# Altium schematic sheet CONNECTIONS.SchDoc: CONNECTIONS
size A4; DocumentNumber: 7; Revision: 2.0; SheetNumber: 7; SheetTotal: 18
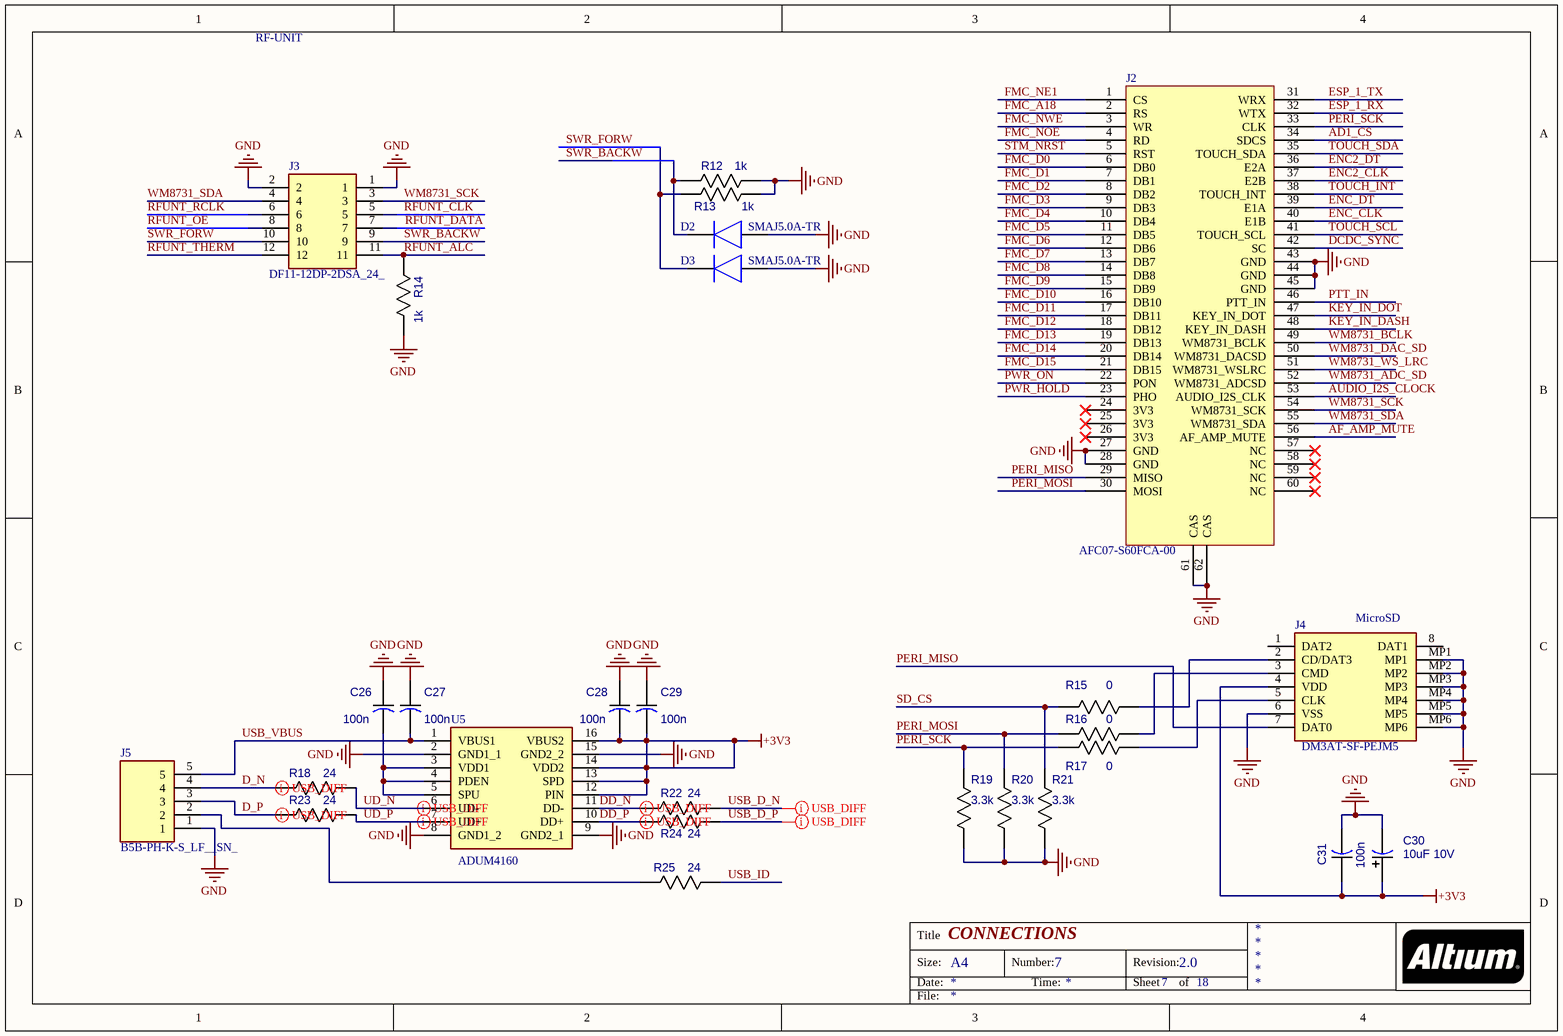
[diagram p0: CONNECTIONS.SchDoc]

## Parts
C26  100n  [CAP_0805]
C27  100n  [CAP_0805]
C28  100n  [CAP_0805]
C29  100n  [CAP_0805]
C30  value 10uF 10V  [CAPAE_4.3x4.3h5.4]  (hidden comment: 22uF 10V)
C31  100n  [CAP_0805]
D2  SMAJ5.0A-TR  [SMBJ36CATR]
D3  SMAJ5.0A-TR  [SMBJ36CATR]
J2  AFC07-S60FCA-00  [AFC07-S60FCA-00]
J3  DF11-12DP-2DSA_24_  [SHDR12W60P200_2X6_1400X500X690P]
J4  DM3AT-SF-PEJM5  [DM3ATSFPEJM5]
J5  B5B-PH-K-S_LF__SN_  [SHDR5W50P0X200_1X5_1190X450X600P]
R12  1k  [RES_0805]
R13  1k  [RES_0805]
R14  1k  [RES_0805]
R15  0  [RES_0805]
R16  0  [RES_0805]
R17  0  [RES_0805]
R18  24  [RES_0805]
R19  3.3k  [RES_0805]
R20  3.3k  [RES_0805]
R21  3.3k  [RES_0805]
R22  24  [RES_0805]
R23  24  [RES_0805]
R24  24  [RES_0805]
R25  24  [RES_0805]
U5  ADUM4160  [SOIC127P1032X265-16N]

## Nets
+3V3: C28.2 C29.2 C30.1(PLUS) C31.1 J4.4(VDD) U5.12(PIN) U5.13(SPD) U5.14(VDD2) U5.16(VBUS2)
GND: C26.1 C27.1 C28.1 C29.1 C30.2(MINUS) C31.2 D2.2(A) D3.2(A) J2.27(GND) J2.28(GND) J2.43(GND) J2.44(GND) J2.45(GND) J2.61(CAS) J2.62(CAS) J3.1 J3.2 J4.6(VSS) J4.MP1 J4.MP2 J4.MP3 J4.MP4 J4.MP5 J4.MP6 J5.1 R12.2 R13.2 R14.2 R19.1 R20.1 R21.1 U5.2(GND1_1) U5.8(GND1_2) U5.9(GND2_1) U5.15(GND2_2)
AD1_CS: J2.34(SDCS)
AF_AMP_MUTE: J2.56(AF_AMP_MUTE)
AUDIO_I2S_CLOCK: J2.53(AUDIO_I2S_CLK)
D_N: J5.4 R18.1
D_P: J5.3 R23.1
DCDC_SYNC: J2.42(SC)
DD_N: R22.1 U5.11(DD-)
DD_P: R24.1 U5.10(DD+)
ENC2_CLK: J2.37(E2B)
ENC2_DT: J2.36(E2A)
ENC_CLK: J2.40(E1B)
ENC_DT: J2.39(E1A)
ESP_1_RX: J2.32(WTX)
ESP_1_TX: J2.31(WRX)
FMC_A18: J2.2(RS)
FMC_D0: J2.6(DB0)
FMC_D1: J2.7(DB1)
FMC_D2: J2.8(DB2)
FMC_D3: J2.9(DB3)
FMC_D4: J2.10(DB4)
FMC_D5: J2.11(DB5)
FMC_D6: J2.12(DB6)
FMC_D7: J2.13(DB7)
FMC_D8: J2.14(DB8)
FMC_D9: J2.15(DB9)
FMC_D10: J2.16(DB10)
FMC_D11: J2.17(DB11)
FMC_D12: J2.18(DB12)
FMC_D13: J2.19(DB13)
FMC_D14: J2.20(DB14)
FMC_D15: J2.21(DB15)
FMC_NE1: J2.1(CS)
FMC_NOE: J2.4(RD)
FMC_NWE: J2.3(WR)
KEY_IN_DASH: J2.48(KEY_IN_DASH)
KEY_IN_DOT: J2.47(KEY_IN_DOT)
PERI_MISO: J2.29(MISO) J4.7(DAT0)
PERI_MOSI: J2.30(MOSI) R16.2 R20.2
PERI_SCK: J2.33(CLK) R17.2 R19.2
PTT_IN: J2.46(PTT_IN)
PWR_HOLD: J2.23(PHO)
PWR_ON: J2.22(PON)
RFUNT_ALC: J3.11 R14.1
RFUNT_CLK: J3.5
RFUNT_DATA: J3.7
RFUNT_OE: J3.8
RFUNT_RCLK: J3.6
RFUNT_THERM: J3.12
SD_CS: R15.2 R21.2
STM_NRST: J2.5(RST)
SWR_BACKW: D2.1(K) J3.9 R12.1
SWR_FORW: D3.1(K) J3.10 R13.1
TOUCH_INT: J2.38(TOUCH_INT)
TOUCH_SCL: J2.41(TOUCH_SCL)
TOUCH_SDA: J2.35(TOUCH_SDA)
UD_N: R18.2 U5.6(UD-)
UD_P: R23.2 U5.7(UD+)
USB_D_N: R22.2
USB_D_P: R24.2
USB_ID: R25.2
USB_VBUS: C27.2 J5.5 U5.1(VBUS1)
WM8731_ADC_SD: J2.52(WM8731_ADCSD)
WM8731_BCLK: J2.49(WM8731_BCLK)
WM8731_DAC_SD: J2.50(WM8731_DACSD)
WM8731_SCK: J2.54(WM8731_SCK) J3.3
WM8731_SDA: J2.55(WM8731_SDA) J3.4
WM8731_WS_LRC: J2.51(WM8731_WSLRC)
NetC26_2: C26.2 U5.3(VDD1) U5.4(PDEN) U5.5(SPU)
NetJ4_2: J4.2(CD/DAT3) R15.1
NetJ4_3: J4.3(CMD) R16.1
NetJ4_5: J4.5(CLK) R17.1
NetJ5_2: J5.2 R25.1

Not connected (* = marked no-connect by the designer): J2 24(3V3)* 25(3V3)* 26(3V3)* 57(NC)* 58(NC)* 59(NC)* 60(NC)*; J4 1(DAT2) 8(DAT1)

## Layout directives
differential pair; differential pair class USB_DIFF: D_N, D_P, DD_N, DD_P, UD_N, UD_P, USB_D_N, USB_D_P

## Notes on the sheet
- RF-UNIT
- (near J4) MicroSD
- Title
- Size:
- Date:
- A4
- Number:
- Time:
- Revision:
- Sheet
- of
- File:

## Library data of the parts
C26-C29 C31 = CAP_0805: Value: 100n
C30 = CAPAE_4.3x4.3h5.4
D2 D3 = SMLVT3V3: Diode; Manufacturer_Name: STMicroelectronics; Allied_Number: 70013736; Datasheet Link: http://www.st.com/web/en/resource/technical/document/datasheet/CD00000923.pdf; Height: 2.65mm; Manufacturer_Part_Number: SMLVT3V3; Mouser Part Number: 511-SMLVT3V3; Mouser Price/Stock: https://www.mouser.com/Search/Refine.aspx?Keyword=511-SMLVT3V3; RS Part Number: 5444821P; RS Price/Stock: http://uk.rs-online.com/web/p/products/5444821P; Allied Price/Stock: http://www.alliedelec.com/stmicroelectronics-smlvt3v3/70013736/
J3 = DF11-12DP-2DSA_24_: Connector; Manufacturer_Name: Hirose; Manufacturer_Part_Number: DF11-12DP-2DSA(24); Datasheet Link: https://datasheet.datasheetarchive.com/originals/distributors/SFDatasheet-7/sf-000141225.pdf; Height: 6.9mm; Mouser Part Number: 798-DF11-12DP-2DSA24; Mouser Price/Stock: https://www.mouser.co.uk/ProductDetail/Hirose-Connector/DF11-12DP-2DSA24?qs=zOgoZG1CgI9hGIQfeQgy6Q%3D%3D; Arrow Part Number: DF11-12DP-2DSA(24); Arrow Price/Stock: https://www.arrow.com/en/products/df11-12dp-2dsa-24/hirose-electric
J4 = DM3AT-SF-PEJM5: Connector; Manufacturer_Name: HRS(Hirose); Datasheet Link: https://datasheet.lcsc.com/szlcsc/Hirose-HRS-DM3AT-SF-PEJM5_C114218.pdf; Height: 1.83mm; Manufacturer_Part_Number: DM3AT-SF-PEJM5
J5 = B5B-PH-K-S_LF__SN_: Connector; Manufacturer_Name: JST (JAPAN SOLDERLESS TERMINALS); Manufacturer_Part_Number: B5B-PH-K-S(LF)(SN); Datasheet Link: http://uk.rs-online.com/web/p/products/8201438; Height: 6mm; Arrow Part Number: B5B-PH-K-S(LF)(SN); Arrow Price/Stock: https://www.arrow.com/en/products/b5b-ph-k-s-lf-sn/jst-manufacturing
R12-R25 = RES_0805
  R12-R14: Value: 1k
  R15-R17: Value: 0
  R19-R21: Value: 3.3k
U5 = ADUM4160BRWZ: Integrated Circuit; Manufacturer_Name: Analog Devices; Datasheet Link: http://uk.rs-online.com/web/p/products/9129526; Height: 2.65mm; Manufacturer_Part_Number: ADUM4160BRWZ; Mouser Part Number: 584-ADUM4160BRWZ; Mouser Price/Stock: https://www.mouser.co.uk/ProductDetail/Analog-Devices/ADUM4160BRWZ/?qs=WIvQP4zGanj8VHq3sVqu9A%3D%3D; Arrow Part Number: ADUM4160BRWZ; Arrow Price/Stock: https://www.arrow.com/en/products/adum4160brwz/analog-devices